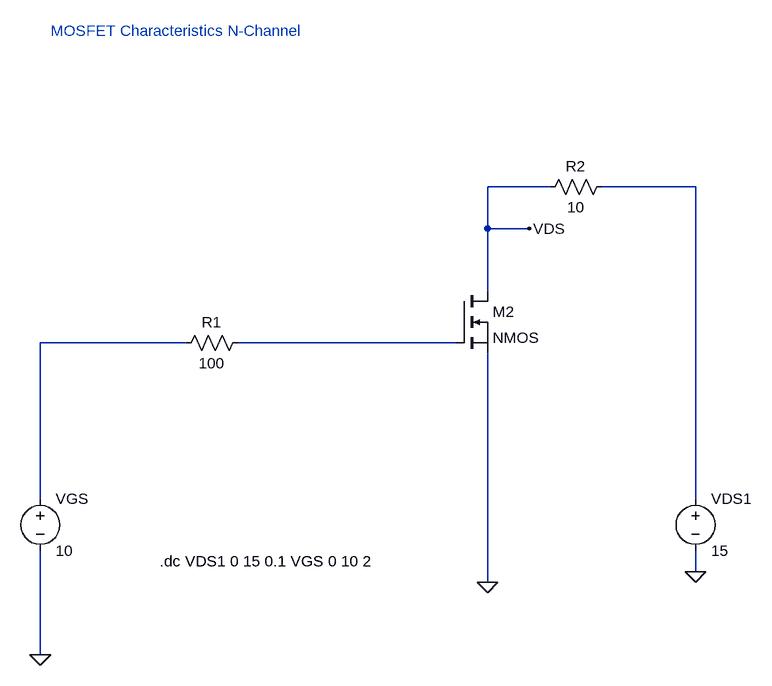
[diagram p0: schematic NMOS_Characteristics.asc]
NMOS_Characteristics.asc, the LTspice schematic file:
Version 4.1
SHEET 1 1032 680
WIRE 720 -352 624 -352
WIRE 944 -352 800 -352
WIRE 624 -288 624 -352
WIRE 688 -288 624 -288
WIRE 624 -192 624 -288
WIRE 160 -112 -64 -112
WIRE 576 -112 240 -112
WIRE -64 128 -64 -112
WIRE 944 128 944 -352
WIRE 944 240 944 208
WIRE 624 256 624 -96
WIRE -64 368 -64 208
FLAG 624 256 0
FLAG 944 240 0
FLAG -64 368 0
FLAG 688 -288 VDS
SYMBOL voltage -64 112 R0
WINDOW 123 0 0 Left 0
WINDOW 39 0 0 Left 0
SYMATTR InstName VGS
SYMATTR Value 10
SYMBOL voltage 944 112 R0
SYMATTR InstName VDS1
SYMATTR Value 15
SYMBOL nmos 576 -192 R0
SYMATTR InstName M2
SYMBOL res 256 -128 R90
WINDOW 0 0 56 VBottom 2
WINDOW 3 32 56 VTop 2
SYMATTR InstName R1
SYMATTR Value 100
SYMBOL res 816 -368 R90
WINDOW 0 0 56 VBottom 2
WINDOW 3 32 56 VTop 2
SYMATTR InstName R2
SYMATTR Value 10
TEXT -48 -592 Left 2 ;MOSFET Characteristics N-Channel
TEXT 120 224 Left 2 !.dc VDS1 0 15 0.1 VGS 0 10 2

The netlist it stands for:
* NMOS_Characteristics.asc
VGS N002 0 10
VDS1 N001 0 15
M2 VDS N003 0 0 NMOS
R1 N003 N002 100
R2 N001 VDS 10
.model NMOS NMOS
.model PMOS PMOS
.lib standard.mos
* MOSFET Characteristics N-Channel
.dc VDS1 0 15 0.1 VGS 0 10 2
.backanno
.end